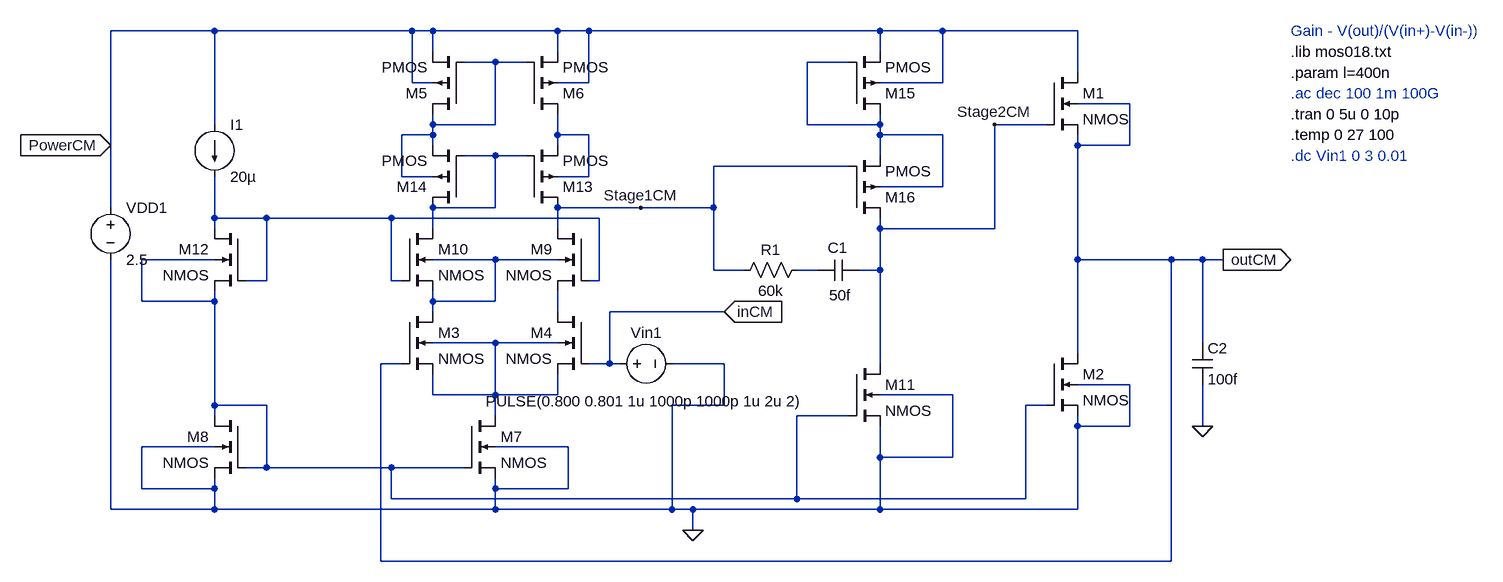
[diagram p0: schematic Settling time.asc]
Settling time.asc, the LTspice schematic file:
Version 4
SHEET 1 1412 680
WIRE -544 -256 -704 -256
WIRE -240 -256 -544 -256
WIRE -208 -256 -240 -256
WIRE -16 -256 -208 -256
WIRE 32 -256 -16 -256
WIRE 480 -256 32 -256
WIRE 576 -256 480 -256
WIRE 784 -256 576 -256
WIRE -208 -224 -208 -256
WIRE -16 -224 -16 -256
WIRE 480 -224 480 -256
WIRE -112 -208 -160 -208
WIRE -64 -208 -112 -208
WIRE 432 -208 368 -208
WIRE 784 -192 784 -256
WIRE -240 -176 -240 -256
WIRE -208 -176 -240 -176
WIRE 32 -176 32 -256
WIRE 32 -176 -16 -176
WIRE 576 -176 576 -256
WIRE 576 -176 480 -176
WIRE 864 -144 784 -144
WIRE -544 -112 -544 -256
WIRE -208 -112 -208 -128
WIRE -112 -112 -112 -208
WIRE -112 -112 -208 -112
WIRE 368 -112 368 -208
WIRE 480 -112 480 -128
WIRE 480 -112 368 -112
WIRE 736 -112 656 -112
WIRE -208 -96 -208 -112
WIRE -208 -96 -256 -96
WIRE -16 -96 -16 -128
WIRE 32 -96 -16 -96
WIRE 480 -96 480 -112
WIRE 576 -96 480 -96
WIRE -704 -80 -704 -256
WIRE -208 -80 -208 -96
WIRE -16 -80 -16 -96
WIRE 784 -80 784 -96
WIRE 864 -80 864 -144
WIRE 864 -80 784 -80
WIRE -112 -64 -160 -64
WIRE -64 -64 -112 -64
WIRE 480 -64 480 -96
WIRE 432 -48 224 -48
WIRE -256 -32 -256 -96
WIRE -208 -32 -256 -32
WIRE 32 -32 32 -96
WIRE 32 -32 -16 -32
WIRE 576 -16 576 -96
WIRE 576 -16 480 -16
WIRE -704 16 -704 -80
WIRE -112 16 -112 -64
WIRE -112 16 -208 16
WIRE 112 16 -16 16
WIRE 224 16 224 -48
WIRE 224 16 112 16
WIRE -544 32 -544 -32
WIRE -464 32 -544 32
WIRE -272 32 -464 32
WIRE 48 32 -272 32
WIRE -544 48 -544 32
WIRE -208 48 -208 16
WIRE -16 48 -16 16
WIRE 480 48 480 32
WIRE 656 48 656 -112
WIRE 656 48 480 48
WIRE -544 96 -656 96
WIRE -112 96 -208 96
WIRE -16 96 -112 96
WIRE 784 96 784 -80
WIRE 928 96 784 96
WIRE 976 96 928 96
WIRE 1008 96 976 96
WIRE 224 112 224 16
WIRE 272 112 224 112
WIRE 384 112 352 112
WIRE 480 112 480 48
WIRE 480 112 448 112
WIRE -464 128 -464 32
WIRE -464 128 -496 128
WIRE -272 128 -272 32
WIRE -256 128 -272 128
WIRE 48 128 48 32
WIRE 48 128 32 128
WIRE -656 160 -656 96
WIRE -544 160 -544 144
WIRE -544 160 -656 160
WIRE -208 160 -208 144
WIRE -112 160 -112 96
WIRE -112 160 -208 160
WIRE -208 176 -208 160
WIRE -16 176 -16 144
WIRE 240 176 64 176
WIRE -112 224 -208 224
WIRE -16 224 -112 224
WIRE 976 224 976 96
WIRE 784 240 784 96
WIRE -256 256 -288 256
WIRE 64 256 64 176
WIRE 64 256 32 256
WIRE 80 256 64 256
WIRE 240 256 160 256
WIRE 480 256 480 112
WIRE 864 288 784 288
WIRE -208 304 -208 272
WIRE -112 304 -112 224
WIRE -112 304 -208 304
WIRE -16 304 -16 272
WIRE -16 304 -112 304
WIRE 592 304 480 304
WIRE -544 320 -544 160
WIRE -464 320 -544 320
WIRE 240 320 240 256
WIRE 240 320 160 320
WIRE 736 320 704 320
WIRE -544 336 -544 320
WIRE -112 336 -112 304
WIRE 432 336 352 336
WIRE 784 352 784 336
WIRE 864 352 864 288
WIRE 864 352 784 352
WIRE 976 352 976 288
WIRE -544 384 -656 384
WIRE 0 384 -112 384
WIRE 480 400 480 352
WIRE 592 400 592 304
WIRE 592 400 480 400
WIRE -464 416 -464 320
WIRE -464 416 -496 416
WIRE -272 416 -464 416
WIRE -160 416 -272 416
WIRE -656 448 -656 384
WIRE -544 448 -544 432
WIRE -544 448 -656 448
WIRE -112 448 -112 432
WIRE 0 448 0 384
WIRE 0 448 -112 448
WIRE -272 464 -272 416
WIRE 352 464 352 336
WIRE 352 464 -272 464
WIRE 704 464 704 320
WIRE 704 464 352 464
WIRE -704 480 -704 96
WIRE -544 480 -544 448
WIRE -544 480 -704 480
WIRE -112 480 -112 448
WIRE -112 480 -544 480
WIRE 160 480 160 320
WIRE 160 480 -112 480
WIRE 192 480 160 480
WIRE 480 480 480 400
WIRE 480 480 192 480
WIRE 784 480 784 352
WIRE 784 480 480 480
WIRE 192 512 192 480
WIRE -288 560 -288 256
WIRE 928 560 928 96
WIRE 928 560 -288 560
FLAG 1008 96 outCM
IOPIN 1008 96 Out
FLAG 192 512 0
FLAG 240 176 inCM
IOPIN 240 176 In
FLAG 112 16 Stage1CM
FLAG 656 -112 Stage2CM
FLAG -704 -80 PowerCM
IOPIN -704 -80 In
FLAG 976 352 0
SYMBOL nmos4 736 -192 R0
SYMATTR InstName M1
SYMATTR Value2 l={l} w=0.5u m=20
SYMBOL nmos4 736 240 R0
SYMATTR InstName M2
SYMATTR Value2 l={l} w=10u m=3
SYMBOL nmos4 -256 176 R0
SYMATTR InstName M3
SYMATTR Value2 l={l} w=0.5u m=1
SYMBOL nmos4 32 176 M0
SYMATTR InstName M4
SYMATTR Value2 l={l} w=0.5u m=1
SYMBOL pmos4 -160 -128 R180
SYMATTR InstName M5
SYMATTR Value2 l={l} w=1u m=2
SYMBOL pmos4 -64 -128 M180
SYMATTR InstName M6
SYMATTR Value2 l={l} w=1u m=2
SYMBOL nmos4 -160 336 R0
SYMATTR InstName M7
SYMATTR Value2 l={l} w=2u
SYMBOL current -544 -112 R0
WINDOW 123 0 0 Left 0
WINDOW 39 0 0 Left 0
SYMATTR InstName I1
SYMATTR Value 20µ
SYMBOL nmos4 -496 336 M0
SYMATTR InstName M8
SYMATTR Value2 l={l} w=10u
SYMBOL voltage -704 0 R0
WINDOW 123 0 0 Left 0
WINDOW 39 0 0 Left 0
SYMATTR InstName VDD1
SYMATTR Value 2.5
SYMBOL voltage 64 256 R270
WINDOW 0 32 56 VTop 2
WINDOW 3 -42 56 VBottom 2
WINDOW 123 -70 56 VBottom 2
WINDOW 39 -1 235 VBottom 2
SYMATTR InstName Vin1
SYMATTR Value PULSE(0.800 0.801 1u 1000p 1000p 1u 2u 2)
SYMBOL nmos4 32 48 M0
SYMATTR InstName M9
SYMATTR Value2 l={l} w=0.5u m=1
SYMBOL nmos4 -256 48 R0
SYMATTR InstName M10
SYMATTR Value2 l={l} w=0.5u m=1
SYMBOL nmos4 432 256 R0
SYMATTR InstName M11
SYMATTR Value2 l={l} w=1u m=5
SYMBOL cap 448 96 R90
WINDOW 0 -3 33 VBottom 2
WINDOW 3 39 29 VTop 2
SYMATTR InstName C1
SYMATTR Value 50f
SYMBOL nmos4 -496 48 M0
SYMATTR InstName M12
SYMATTR Value2 l={l} w=1u
SYMBOL pmos4 -64 16 M180
SYMATTR InstName M13
SYMATTR Value2 l={l} w=1u m=1
SYMBOL pmos4 -160 16 R180
SYMATTR InstName M14
SYMATTR Value2 l={l} w=1u m=1
SYMBOL pmos4 432 -128 M180
SYMATTR InstName M15
SYMATTR Value2 l={l} w=0.5u m=25
SYMBOL pmos4 432 32 M180
SYMATTR InstName M16
SYMATTR Value2 l={l} w=0.5u m=10
SYMBOL res 368 96 R90
WINDOW 0 0 56 VBottom 2
WINDOW 3 32 56 VTop 2
SYMATTR InstName R1
SYMATTR Value 60k
SYMBOL cap 960 224 R0
SYMATTR InstName C2
SYMATTR Value 100f
TEXT 1112 -128 Left 2 !.tran 0 5u 0 10p
TEXT 1112 -96 Left 2 !.temp 0 27 100
TEXT 1112 -160 Left 2 ;.ac dec 100 1m 100G
TEXT 1112 -192 Left 2 !.param l=400n
TEXT 1112 -224 Left 2 !.lib mos018.txt
TEXT 1112 -256 Left 2 ;Gain - V(out)/(V(in+)-V(in-))
TEXT 1112 -64 Left 2 ;.dc Vin1 0 3 0.01

The netlist it stands for:
* Settling time.asc
M1 PowerCM Stage2CM outCM outCM NMOS l={l} w=0.5u m=20
M2 outCM N006 0 0 NMOS l={l} w=10u m=3
M3 N007 outCM N010 N010 NMOS l={l} w=0.5u m=1
M4 N009 inCM N010 N010 NMOS l={l} w=0.5u m=1
M5 N001 N001 PowerCM PowerCM PMOS l={l} w=1u m=2
M6 N003 N001 PowerCM PowerCM PMOS l={l} w=1u m=2
M7 N010 N006 0 0 NMOS l={l} w=2u
I1 PowerCM N005 20µ
M8 N006 N006 0 0 NMOS l={l} w=10u
VDD1 PowerCM 0 2.5
Vin1 inCM 0 PULSE(0.800 0.801 1u 1000p 1000p 1u 2u 2)
M9 Stage1CM N005 N009 N007 NMOS l={l} w=0.5u m=1
M10 N004 N005 N007 N007 NMOS l={l} w=0.5u m=1
M11 Stage2CM N006 0 0 NMOS l={l} w=1u m=5
C1 Stage2CM N008 50f
M12 N005 N005 N006 N006 NMOS l={l} w=1u
M13 Stage1CM N004 N003 N003 PMOS l={l} w=1u m=1
M14 N004 N004 N001 N001 PMOS l={l} w=1u m=1
M15 N002 N002 PowerCM PowerCM PMOS l={l} w=0.5u m=25
M16 Stage2CM Stage1CM N002 N002 PMOS l={l} w=0.5u m=10
R1 N008 Stage1CM 60k
C2 outCM 0 100f
.model NMOS NMOS
.model PMOS PMOS
.lib standard.mos
.tran 0 5u 0 10p
.temp 0 27 100
* .ac dec 100 1m 100G
.param l=400n
.lib mos018.txt
* Gain - V(out)/(V(in+)-V(in-))
* .dc Vin1 0 3 0.01
.backanno
.end